# Altium schematic sheet SCH5_Main_computer_USB2-0.SchDoc: Main Computer - USB 2.0
size B; Organization: CWRUbotix; Address1: 10900 Euclid Avenue; Address2: Cleveland, OH 44106; Address3: USA; Revision: 1.0; SheetNumber: 5; SheetTotal: 13
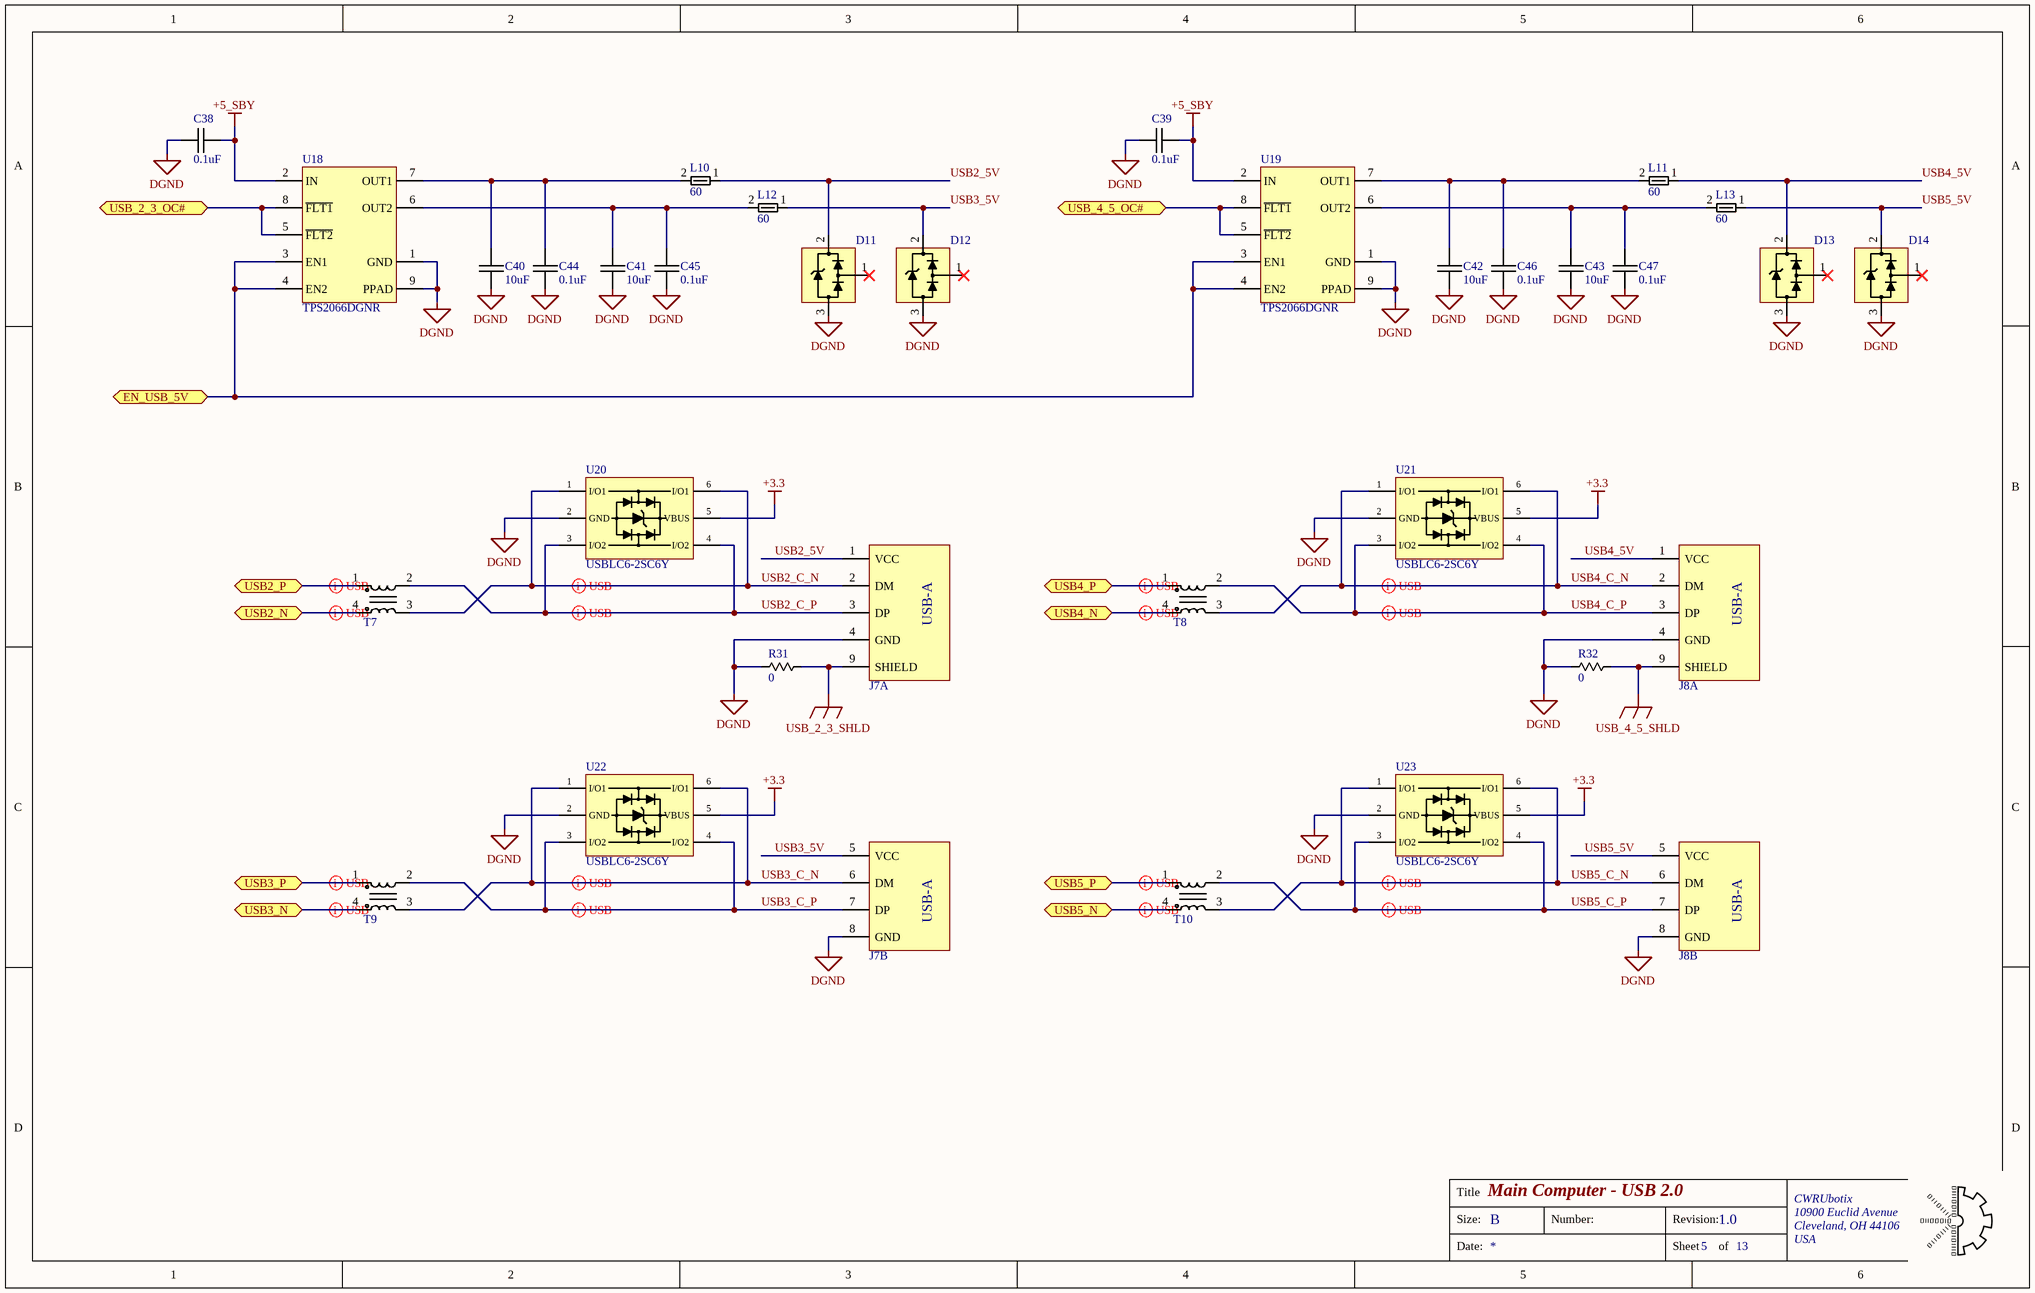
[diagram p0: SCH5_Main_computer_USB2-0.SchDoc]

## Parts
C38  0.1uF  [chip_0603]
C39  0.1uF  [chip_0603]
C40  10uF  [chip_1206]
C41  10uF  [chip_1206]
C42  10uF  [chip_1206]
C43  10uF  [chip_1206]
C44  0.1uF  [chip_0603]
C45  0.1uF  [chip_0603]
C46  0.1uF  [chip_0603]
C47  0.1uF  [chip_0603]
D11  DLPT05  [sot-23-3]  (value not drawn)
D12  DLPT05  [sot-23-3]  (value not drawn)
D13  DLPT05  [sot-23-3]  (value not drawn)
D14  DLPT05  [sot-23-3]  (value not drawn)
J7  usb_a_x2  [CUI_UJ2-ADH-1-TH]  (value not drawn)  (parts A,B of 2)
J8  usb_a_x2  [CUI_UJ2-ADH-1-TH]  (value not drawn)  (parts A,B of 2)
L10  Impedance: 60  [CHIP_0805_FE]  (hidden comment: bead_0)
L11  Impedance: 60  [CHIP_0805_FE]  (hidden comment: bead_0)
L12  Impedance: 60  [CHIP_0805_FE]  (hidden comment: bead_0)
L13  Impedance: 60  [CHIP_0805_FE]  (hidden comment: bead_0)
R31  0  [chip_0805]
R32  0  [chip_0805]
T7  DLW21HN900SQ2L  [MURATA_DLW21H]  (value not drawn)
T8  DLW21HN900SQ2L  [MURATA_DLW21H]  (value not drawn)
T9  DLW21HN900SQ2L  [MURATA_DLW21H]  (value not drawn)
T10  DLW21HN900SQ2L  [MURATA_DLW21H]  (value not drawn)
U18  TPS2066DGNR  [VSSOP-8-PPAD]
U19  TPS2066DGNR  [VSSOP-8-PPAD]
U20  USBLC6-2SC6Y  [sot-23-6]
U21  USBLC6-2SC6Y  [sot-23-6]
U22  USBLC6-2SC6Y  [sot-23-6]
U23  USBLC6-2SC6Y  [sot-23-6]

## Ports
EN_USB_5V (bidir), USB2_N (bidir), USB2_P (bidir), USB3_N (bidir), USB3_P (bidir), USB4_N (bidir), USB4_P (bidir), USB5_N (bidir), USB5_P (bidir), USB_2_3_OC# (bidir), USB_4_5_OC# (bidir)

## Nets
+3.3: U20.5(VBUS) U21.5(VBUS) U22.5(VBUS) U23.5(VBUS)
+5_SBY: C38.2 C39.2 U18.2(IN) U19.2(IN)
DGND: C38.1 C39.1 C40.2 C41.2 C42.2 C43.2 C44.1 C45.1 C46.1 C47.1 D11.3(GND) D12.3(GND) D13.3(GND) D14.3(GND) J7.4(GND) J7.8(GND) J8.4(GND) J8.8(GND) R31.1 R32.1 U18.1(GND) U18.9(PPAD) U19.1(GND) U19.9(PPAD) U20.2(GND) U21.2(GND) U22.2(GND) U23.2(GND)
USB_2_3_SHLD: J7.9(SHIELD) R31.2
USB_4_5_SHLD: J8.9(SHIELD) R32.2
EN_USB_5V: U18.3(EN1) U18.4(EN2) U19.3(EN1) U19.4(EN2) ; port EN_USB_5V
USB2_5V: D11.2(VCC) J7.1(VCC) L10.1
USB2_C_N: J7.2(DM) T7.3 U20.1(I/O1) U20.6(I/O1)
USB2_C_P: J7.3(DP) T7.2 U20.3(I/O2) U20.4(I/O2)
USB2_N: T7.4 ; port USB2_N
USB2_P: T7.1 ; port USB2_P
USB3_5V: D12.2(VCC) J7.5(VCC) L12.1
USB3_C_N: J7.6(DM) T9.3 U22.1(I/O1) U22.6(I/O1)
USB3_C_P: J7.7(DP) T9.2 U22.3(I/O2) U22.4(I/O2)
USB3_N: T9.4 ; port USB3_N
USB3_P: T9.1 ; port USB3_P
USB4_5V: D13.2(VCC) J8.1(VCC) L11.1
USB4_C_N: J8.2(DM) T8.3 U21.1(I/O1) U21.6(I/O1)
USB4_C_P: J8.3(DP) T8.2 U21.3(I/O2) U21.4(I/O2)
USB4_N: T8.4 ; port USB4_N
USB4_P: T8.1 ; port USB4_P
USB5_5V: D14.2(VCC) J8.5(VCC) L13.1
USB5_C_N: J8.6(DM) T10.3 U23.1(I/O1) U23.6(I/O1)
USB5_C_P: J8.7(DP) T10.2 U23.3(I/O2) U23.4(I/O2)
USB5_N: T10.4 ; port USB5_N
USB5_P: T10.1 ; port USB5_P
USB_2_3_OC#: U18.5(~{FLT2}) U18.8(~{FLT1}) ; port USB_2_3_OC#
USB_4_5_OC#: U19.5(~{FLT2}) U19.8(~{FLT1}) ; port USB_4_5_OC#
NetC40_1: C40.1 C44.2 L10.2 U18.7(OUT1)
NetC41_1: C41.1 C45.2 L12.2 U18.6(OUT2)
NetC42_1: C42.1 C46.2 L11.2 U19.7(OUT1)
NetC43_1: C43.1 C47.2 L13.2 U19.6(OUT2)

Not connected (* = marked no-connect by the designer): D11 1(LINE)*; D12 1(LINE)*; D13 1(LINE)*; D14 1(LINE)*

## Layout directives
differential pair: USB2_C_N, USB2_C_P, USB2_N, USB2_P, USB3_C_N, USB3_C_P, USB3_N, USB3_P, USB4_C_N, USB4_C_P, USB4_N, USB4_P, USB5_C_N, USB5_C_P, USB5_N, USB5_P

## Notes on the sheet
- Title
- Size:
- B
- Number:
- Revision:
- Date:
- Sheet
- of
- (in symbol CONN-00068, part A) USB-A
- (in symbol CONN-00068, part B) USB-A

## Library data of the parts
C38 C39 C44-C47 = CAP-00542: CAP, 0.1uF, ±10%, 16V, X7R, 0603; Manufacturer: Murata; Part Number: CAP-00542; Capacitance: 0.1uF; Tolerance: ±10%; Voltage Rating: 16V; Type: X7R
C40-C43 = CAP-00539: CAP, 10uF, ±10%, 25V, X7R, 1206; Manufacturer: Samsung; Manufacturer PN: CL31B106KAHNNNE; Part Number: CAP-00539; Capacitance: 10uF; Tolerance: ±10%; Voltage Rating: 25V; Type: X7R
D11-D14 = DIO-00057: TVS, Steering (Rail-Rail), 9.8V Clamping, 17A Peak Pulse, SOT-23; Manufacturer: Diodes Incorporated; Manufacturer PN: DLPT05-7-F; Reverse Breakdown Voltage: 6.0V; Part Number: DIO-00057; Type: TVS; Cost: 0.38
J7 J8 = CONN-00068: USB-A Jack x2, USB 2.0, Right-Angle, Thru-Hole; Manufacturer: CUI; Manufacturer PN: UJ2-ADH-1-TH; Positions per level: 4; Levels: 2; Part Number: CONN-00068; Type: Jack; Cost: 0.95
L10-L13 = MAG-00125: Fe Bead, 60 @ 100MH, 3A, 0805; Manufacturer: Pulse Electronics; Manufacturer PN: PE-0805PFB600ST; Test Freq: 100MHz; DCR: 25mOhm; Part Number: MAG-00125; Current Rating: 3A; Cost: 0.1
R31 R32 = RES-00720: RES SMD 0 OHM 1/8W 0805 Thick Film; Manufacturer: Stackpole; Manufacturer PN: RMCF0805ZT0R00; Tolerance: Jumper; Part Number: RES-00720; Resistance: 0; Power Rating: 1/8W; Cost: 0.1
T7-T10 = MAG-00121: CMC, 330mA 2-CH 90 OHM @ 100MHz SMD; Manufacturer: Murata; Impedance: 90; DCR: 350mOhm; Part Number: MAG-00121; Test Freq: 100MHz; Manufacturer PN: DLW21HN900SQ2L; Cost: 0.53
U18 U19 = PWREG-00052: IC, Power Switch 1:2, 8-MSOP; Manufacturer: TI; Voltage Range In: 2.7 ~ 5.5V; Max Current: 1A; Part Number: PWREG-00052; Voltage Range Out: 2.7 ~ 5.5V; Reg Type: Power Switch; Manufacturer PN: TPS2066DGNR; Cost: 1.56
U20-U23 = DIO-00069: ESD Protec, 2-Ch, 2.5pF, 17V clamping voltage, SOT23-6; Manufacturer: ST; Forward Voltage: 1.1V; Reverse Breakdown Voltage: 6V; Current Rating: 5A; Part Number: DIO-00069; Type: TVS; Manufacturer PN: USBLC6-2SC6Y; Cost: 0.73